# Altium schematic sheet CON_VIDEO_IN.SchDoc: S-Video and Composite Connectors
size A4; SheetNumber: 1; SheetTotal: 100
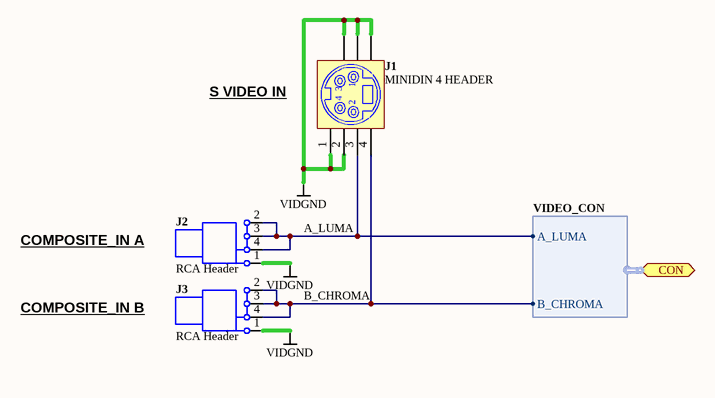
[diagram p0: CON_VIDEO_IN.SchDoc]

## Parts
J1  MINIDIN 4 HEADER  [MDJ-F-04]
J2  RCA Header  [TRC-005]
J3  RCA Header  [TRC-005]

## Ports
CON (harness VIDEO_CON)

## Harnesses
VIDEO_CON: A_LUMA, B_CHROMA

## Nets
VIDGND: J1.1(D) J1.2(A) J1.MH1 J1.MH2 J1.MH3 J2.1(Black) J3.1(Black)
A_LUMA: J1.3(H) J2.2(Yellow) J2.3(White) J2.4(Red) ; port CON.A_LUMA
B_CHROMA: J1.4(E) J3.2(Yellow) J3.3(White) J3.4(Red) ; port CON.B_CHROMA

## Notes on the sheet
- (near J1) S VIDEO IN
- COMPOSITE_IN A
- COMPOSITE_IN B
- Sheet Title
- Project Title
- Size:
- Date:
- A4
- Assy:
- Time:
- Revision:
- Sheet
- of
- File:

## Library data of the parts
J1 = D-300-0050: Connector, 4850.241, Mini-DIN 4-Way, S-Video/Yellow; Max Current: mA; Category: Connector; Connector type: Header; Mounting Technology: Through-Hole; Status: Unreleased
J2 J3 = D-300-0051: Connector, TRC-005-4 , RCA Phono Jack, Right Angle, Thru-Hole, Snap-In; Max Current: mA; Category: Connector; Connector type: Header; Mounting Technology: Through-Hole; Status: Unreleased